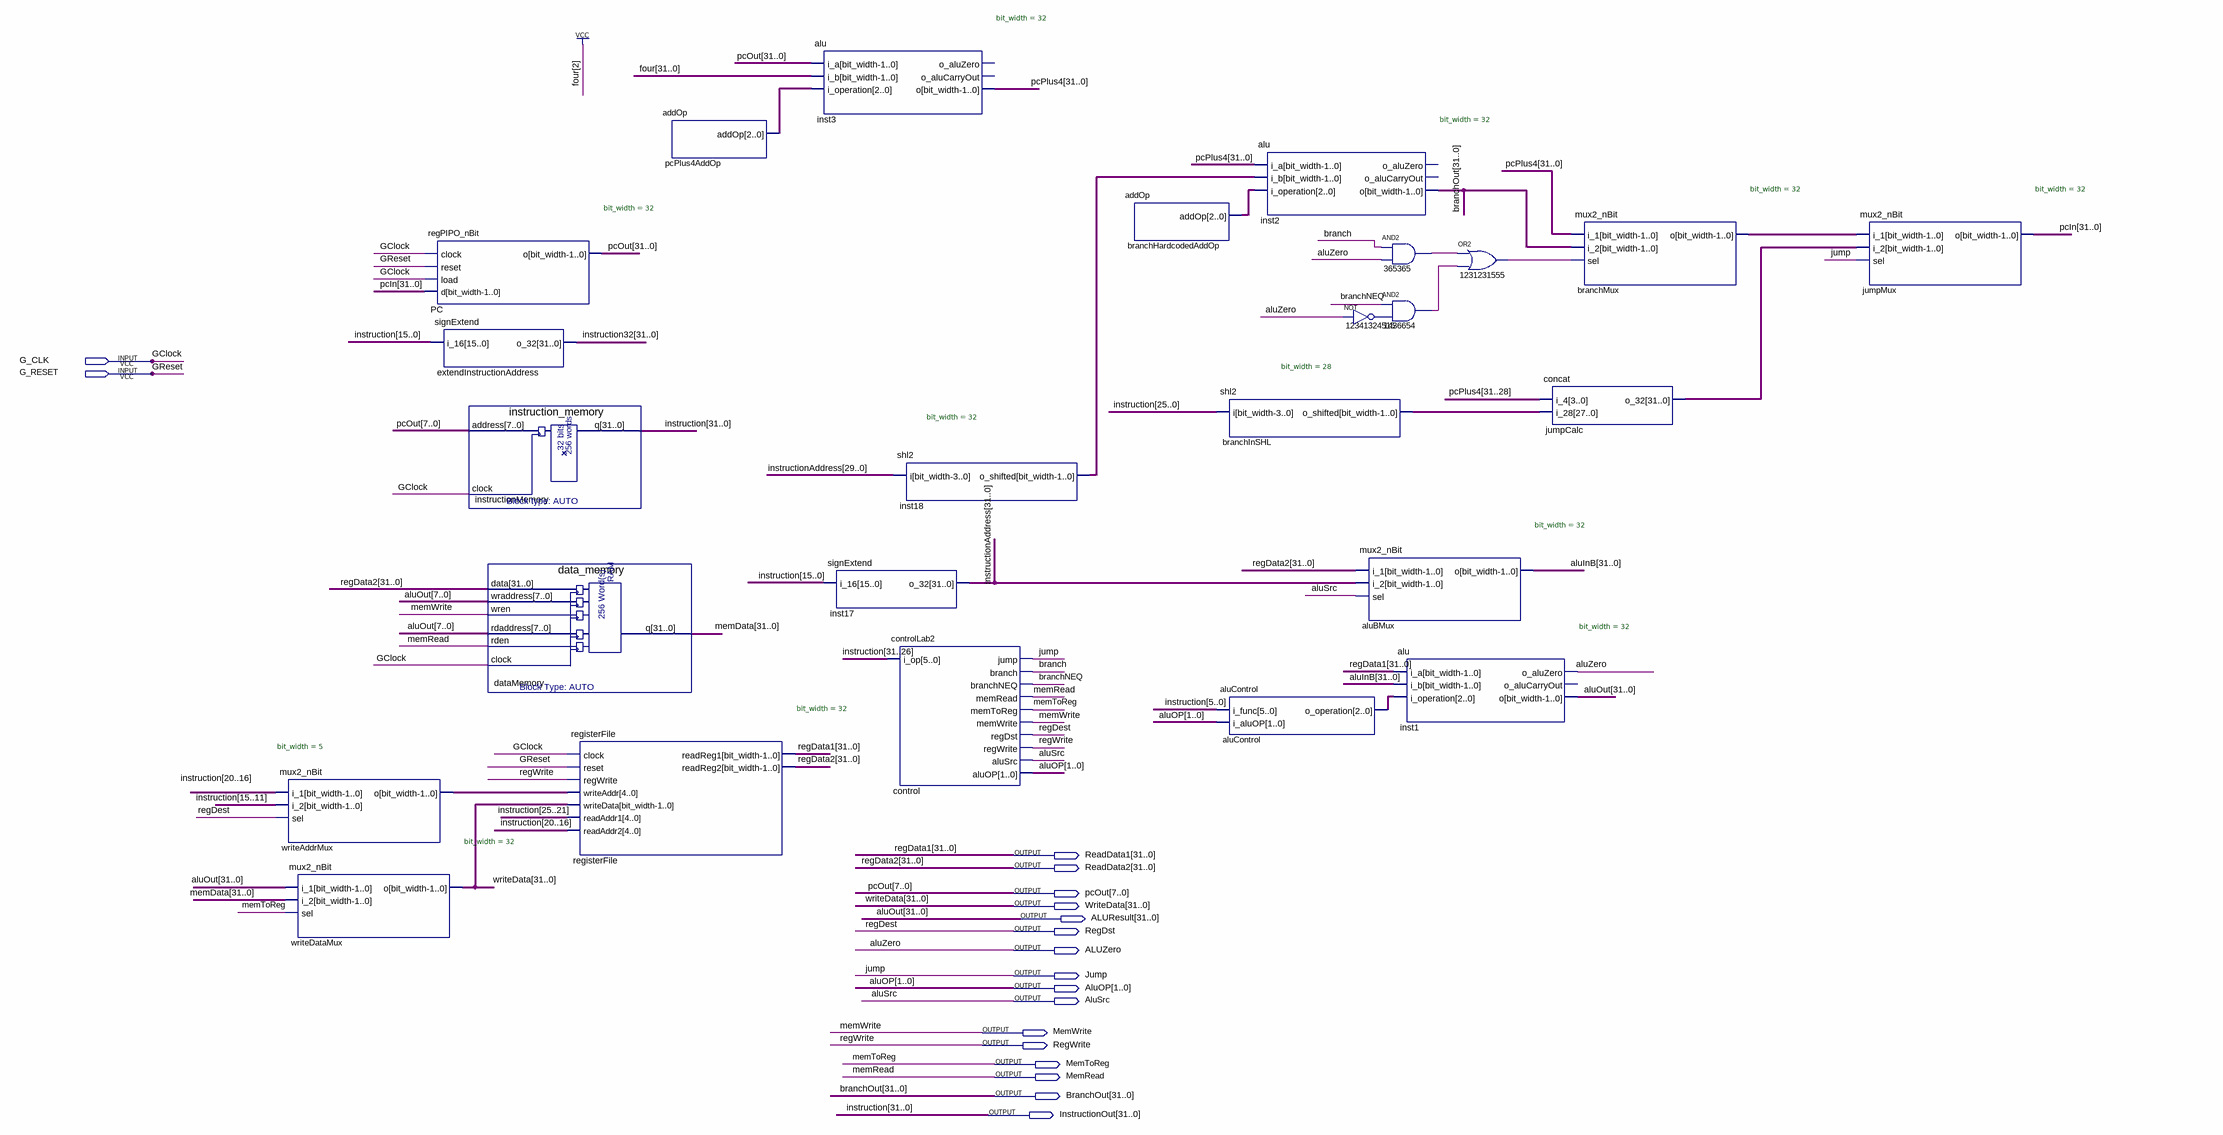
[diagram p0: schematic sheet]
// Quartus schematic lab3.bdf as structural Verilog: 25 symbols, 18 pins
module lab3 (
  input  G_CLK,
  input  G_RESET,
  output [31:0] ReadData1,
  output [31:0] ReadData2,
  output [31:0] pcOut,
  output [31:0] WriteData,
  output [31:0] ALUResult,
  output RegDst,
  output ALUZero,
  output Jump,
  output [1:0] AluOP,
  output AluSrc,
  output MemWrite,
  output RegWrite,
  output MemToReg,
  output MemRead,
  output [31:0] BranchOut,
  output [31:0] InstructionOut
);

  wire branch, branchNEQ, n365365_out, n1436654_out, n1231231555_out, n12341324515_out;
  wire [2:0] aluControl_o_operation, branchHardcodedAddOp_addop, pcPlus4AddOp_addop;
  wire [4:0] writeAddrMux_o;
  wire [27:0] branchInSHL_o_shifted;
  wire [31:0] aluInB, branchMux_o, four, inst18_o_shifted, instruction32, instructionAddress, jumpCalc_o_32,
       memData, pcIn, pcPlus4;

  mux2_nBit #(.bit_width(5)) writeAddrMux (
    .i_1(InstructionOut[20:16]), .i_2(InstructionOut[15:11]), .sel(RegDst), .o(writeAddrMux_o));
  mux2_nBit #(.bit_width(32)) writeDataMux (.i_1(ALUResult), .i_2(memData), .sel(MemToReg), .o(WriteData));
  regPIPO_nBit #(.bit_width(32)) PC (.clock(G_CLK), .reset(G_RESET), .load(G_CLK), .d(pcIn), .o(pcOut));
  signExtend extendInstructionAddress (.i_16(InstructionOut[15:0]), .o_32(instruction32));
  instruction_memory instructionMemory (.address(pcOut[7:0]), .clock(G_CLK), .q(InstructionOut));
  data_memory dataMemory (
    .data(ReadData2), .wraddress(ALUResult[7:0]), .wren(MemWrite), .rdaddress(ALUResult[7:0]),
    .rden(MemRead), .clock(G_CLK), .q(memData));
  registerFile #(.bit_width(32)) registerFile (
    .clock(G_CLK), .reset(G_RESET), .regWrite(RegWrite), .writeAddr(writeAddrMux_o), .writeData(WriteData),
    .readAddr1(InstructionOut[25:21]), .readAddr2(InstructionOut[20:16]), .readReg1(ReadData1),
    .readReg2(ReadData2));
  addOp pcPlus4AddOp (.addOp(pcPlus4AddOp_addop));
  alu #(.bit_width(32)) inst3 (
    .i_a(pcOut), .i_b({four[31:3], 1'b1, four[1:0]}), .i_operation(pcPlus4AddOp_addop), .o(pcPlus4));  // open: o_aluZero, o_aluCarryOut
  signExtend inst17 (.i_16(InstructionOut[15:0]), .o_32(instructionAddress));
  shl2 #(.bit_width(32)) inst18 (.i(instructionAddress[29:0]), .o_shifted(inst18_o_shifted));
  controlLab2 control (
    .i_op(InstructionOut[31:26]), .jump(Jump), .branch(branch), .branchNEQ(branchNEQ), .memRead(MemRead),
    .memToReg(MemToReg), .memWrite(MemWrite), .regDst(RegDst), .regWrite(RegWrite), .aluSrc(AluSrc),
    .aluOP(AluOP));
  addOp branchHardcodedAddOp (.addOp(branchHardcodedAddOp_addop));
  alu #(.bit_width(32)) inst2 (
    .i_a(pcPlus4), .i_b(inst18_o_shifted), .i_operation(branchHardcodedAddOp_addop), .o(BranchOut));  // open: o_aluZero, o_aluCarryOut
  shl2 #(.bit_width(28)) branchInSHL (.i(InstructionOut[25:0]), .o_shifted(branchInSHL_o_shifted));
  aluControl aluControl (.i_func(InstructionOut[5:0]), .i_aluOP(AluOP), .o_operation(aluControl_o_operation));
  not u_12341324515 (n12341324515_out, ALUZero);
  mux2_nBit #(.bit_width(32)) aluBMux (.i_1(ReadData2), .i_2(instructionAddress), .sel(AluSrc), .o(aluInB));
  and u_365365 (n365365_out, branch, ALUZero);
  and u_1436654 (n1436654_out, branchNEQ, n12341324515_out);
  alu #(.bit_width(32)) inst1 (
    .i_a(ReadData1), .i_b(aluInB), .i_operation(aluControl_o_operation), .o_aluZero(ALUZero), .o(ALUResult));  // open: o_aluCarryOut
  or u_1231231555 (n1231231555_out, n365365_out, n1436654_out);
  concat jumpCalc (.i_4(pcPlus4[31:28]), .i_28(branchInSHL_o_shifted), .o_32(jumpCalc_o_32));
  mux2_nBit #(.bit_width(32)) branchMux (.i_1(pcPlus4), .i_2(BranchOut), .sel(n1231231555_out), .o(branchMux_o));
  mux2_nBit #(.bit_width(32)) jumpMux (.i_1(branchMux_o), .i_2(jumpCalc_o_32), .sel(Jump), .o(pcIn));

  // Other names for the same wires on the sheet: aluOut[31:0] = ALUResult; GClock = G_CLK; GReset = G_RESET;
  //   instruction[31:0] = InstructionOut; regData1[31:0] = ReadData1; regData2[31:0] = ReadData2; regDest = RegDst
endmodule
